# Altium project FT232B.PrjPcb
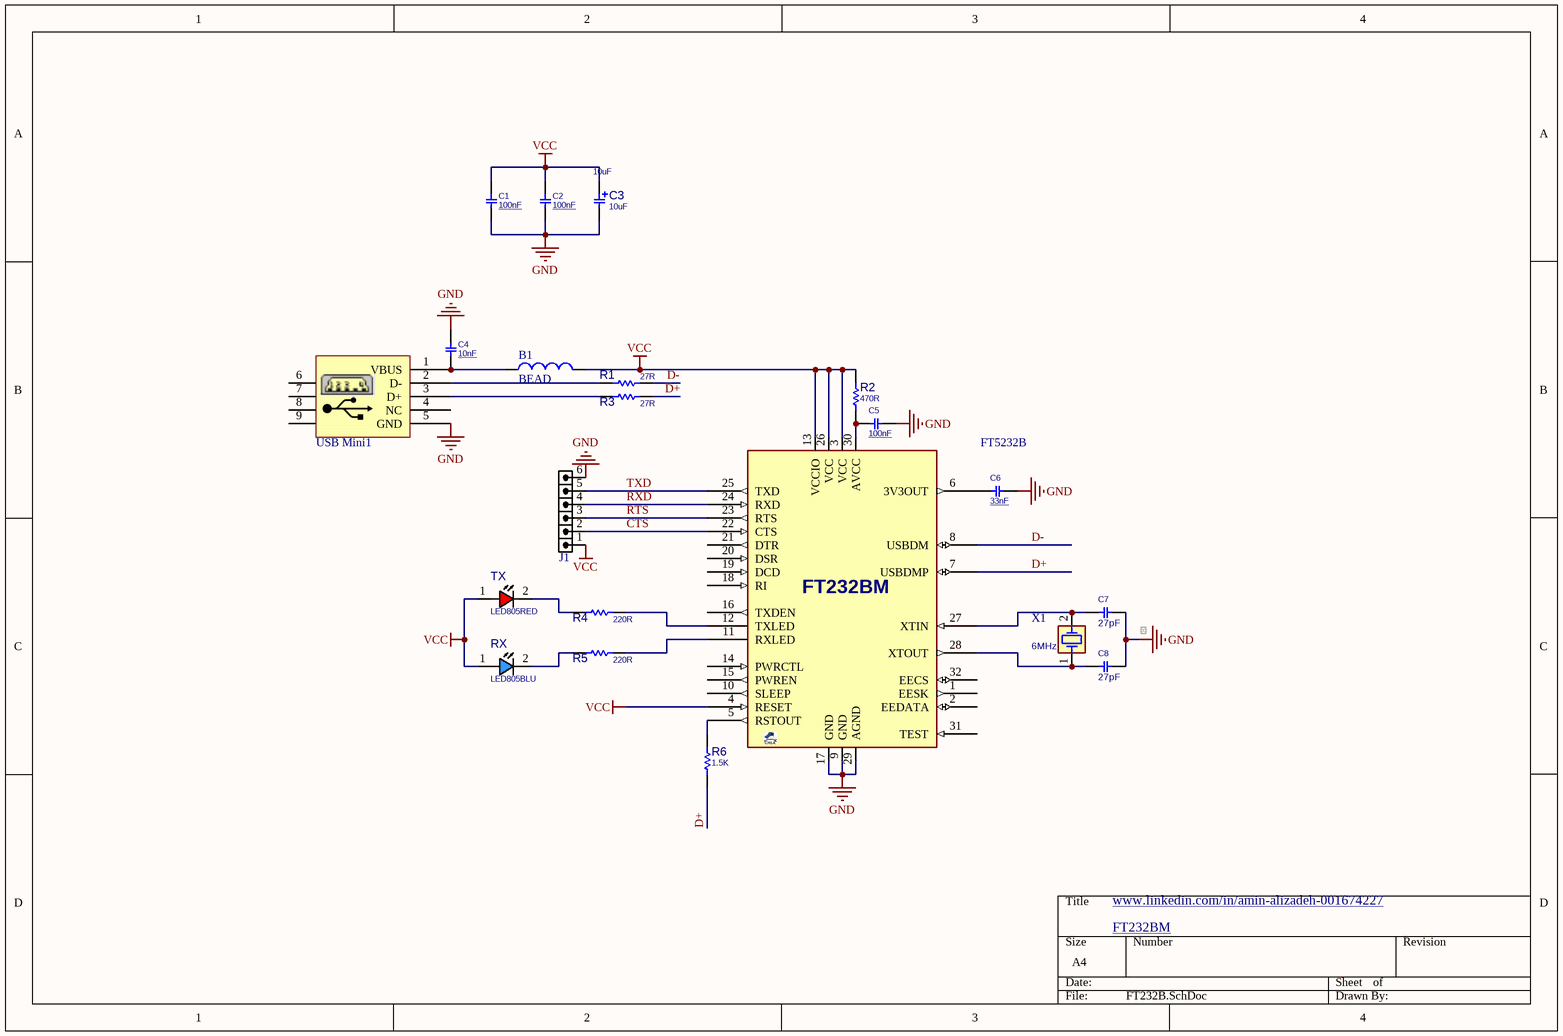
[diagram p0: FT232B.SchDoc]
1 sheet, 21 parts. Net scope: global (net labels, ports and power ports of the same name join across sheets).
Board file: FT232B.PcbDoc

## Sheet FT232B.SchDoc
size A4; SheetNumber: 1; SheetTotal: 1

### Parts
B1  BEAD  [RES 0805 (2012X06L)]
C1  100nF  [C0805]
C2  100nF  [C0805]
C3  10uF  [C_EL_8]
C4  10nF  [C0805]
C5  100nF  [C0805]
C6  33nF  [C0805]
C7  27pF  [C0805]
C8  27pF  [C0805]
FT5232B  FT232BM  [QFG80_32]  (value not drawn)
J1  HDR1X6  [HDRR_M_1X6]  (value not drawn)
R1  27R  [R0805]
R2  470R  [R0805]
R3  27R  [R0805]
R4  220R  [R0805]
R5  220R  [R0805]
R6  1.5K  [R0805]
RX  LED805BLU  [LED0805BLU]
TX  LED805RED  [LED0805RED]
USB_Mini1  USB_Mini  [USB_Mini.2]  (value not drawn)
X1  6MHz  [XTL_2_11X5]

### Nets
GND: C1.2 C2.2 C3.2 C4.1 C5.1 C6.2 C7.1 C8.1 FT5232B.9(GND) FT5232B.17(GND) FT5232B.29(AGND) J1.6 USB_Mini1.5(GND)
VCC: B1.2 C1.1 C2.1 C3.1 FT5232B.3(VCC) FT5232B.4(RESET) FT5232B.13(VCCIO) FT5232B.26(VCC) J1.1 R2.2 RX.1(ANODE) TX.1(ANODE)
CTS: FT5232B.22(CTS) J1.2
D+: FT5232B.7(USBDMP) R3.1 R6.2
D-: FT5232B.8(USBDM) R1.1
RTS: FT5232B.23(RTS) J1.3
RXD: FT5232B.24(RXD) J1.4
TXD: FT5232B.25(TXD) J1.5
NetB1_1: B1.1 C4.2 USB_Mini1.1(VBUS)
NetC5_2: C5.2 FT5232B.30(AVCC) R2.1
NetC6_1: C6.1 FT5232B.6(3V3OUT)
NetC7_2: C7.2 FT5232B.27(XTIN) X1.2(OSC2)
NetC8_2: C8.2 FT5232B.28(XTOUT) X1.1(OSC1)
NetFT5232B_5: FT5232B.5(RSTOUT) R6.1
NetFT5232B_11: FT5232B.11(RXLED) R5.1
NetFT5232B_12: FT5232B.12(TXLED) R4.1
NetR1_2: R1.2 USB_Mini1.2(D-)
NetR3_2: R3.2 USB_Mini1.3(D+)
NetR4_2: R4.2 TX.2(CATHODE)
NetR5_2: R5.2 RX.2(CATHODE)

Not connected (* = marked no-connect by the designer): FT5232B 1(EESK) 2(EEDATA) 10(SLEEP) 14(PWRCTL) 15(PWREN) 16(TXDEN) 18(RI) 19(DCD) 20(DSR) 21(DTR) 31(TEST) 32(EECS); USB_Mini1 4(NC) 6 7 8 9

### Notes on the sheet
- www.linkedin.com/in/amin-alizadeh-001674227 <http://www.linkedin.com/in/amin-alizadeh-001674226>
- FT232BM <http://www.linkedin.com/in/amin-alizadeh-001674226>

### Library data of the parts
B1 = FERIT BEAD: FERIT BEAD SMD 1206
C1 C2 C4-C6 = CAP_SMD_MLCC_0805: CAP, MLCC, -F, -V, MATERIAL, -%, 0201; PARAM: -, -%; MANF_P#: MANF_PART#; PRICE: 100= 1$; MANF: -; PARAM2: -V; ASSEMBLY: ASSEMBLY
  C1 C2 C5: VALUE: 100nF
  C4: VALUE: 10nF
  C6: VALUE: 33nF
C3 = CAP_SMD_EL_8: CAP, THD, ELEC,; MANF_P#: MANF_PART#; PARAM2: -V; DESC: DESCRIPTION; DIST#: MOUSER; PARAM: 20%; PRICE: 10= -$; MANF: MANF; ASSEMBLY: ASSEMBLY; VALUE: 10uF
C7 C8 = CAP_SMD_MLCC_0805: CAP, MLCC; PARAM: -, -%; MANF_P#: MANF_PART#; PARAM2: -V; PRICE: 100= 1$; MANF: -; ASSEMBLY: ASSEMBLY; VALUE: 27pF
FT5232B = FT232BM_QFP32: USB-UART; MANF: FTDI; MANF_P#: FT232BM; VALUE: FT232BM
J1 = HDRR_M_1X6: CONN, HEADER, Male, pitch: 2.54mm, 6POS; VALUE: HDRM6
R1-R6 = RES_SMD_0805: RESISTOR, SMD; PARAM: -W; DESC: DESCRIPTION; DIST#: MOUSER; PARAM2: 1%; MANF_P#: -; MANF: -; ASSEMBLY: ASSEMBLY; PRICE: 100= 0.5$
  R1 R3: VALUE: 27R
  R2: VALUE: 470R
  R4 R5: VALUE: 220R
  R6: VALUE: 1.5K
RX = LED_SMD_0805_BLU: LED, SMD, 0805, BLUE; DESC: DESCRIPTION; MANF_P#: MANF_PART#; PARAM2: 2.2V; MANF: MANF; ASSEMBLY: ASSEMBLY; PRICE: 36t@Javan; VALUE: LED805BLU
TX = LED_SMD_0805_RED: LED, SMD, 0805, RED; DESC: DESCRIPTION; MANF_P#: MANF_PART#; PARAM2: 2.2V; MANF: MANF; ASSEMBLY: ASSEMBLY; PRICE: 36t@Javan; VALUE: LED805RED
USB_Mini1 = USB_Mini: USB Mini; LatestRevisionDate: 17-Jul-2002; LatestRevisionNote: Re-released for DXP Platform.; Publisher: Altium Limited
X1 = XTL_2_HC49_8MHz_SMD: Crystal MOST POPULAR ABL HC49 PACKAGE; MANF: ABRACON; MANF_P#: ABLS-8.000MHZ-B4-T; PARAM: 8MHz, 18pF, 30PPM, -20~70oC; PRICE: 0.3$; VALUE: 6MHz